# Altium schematic sheet 03.MCU_PA_JTAG.SchDoc
size 297 x 209 mm
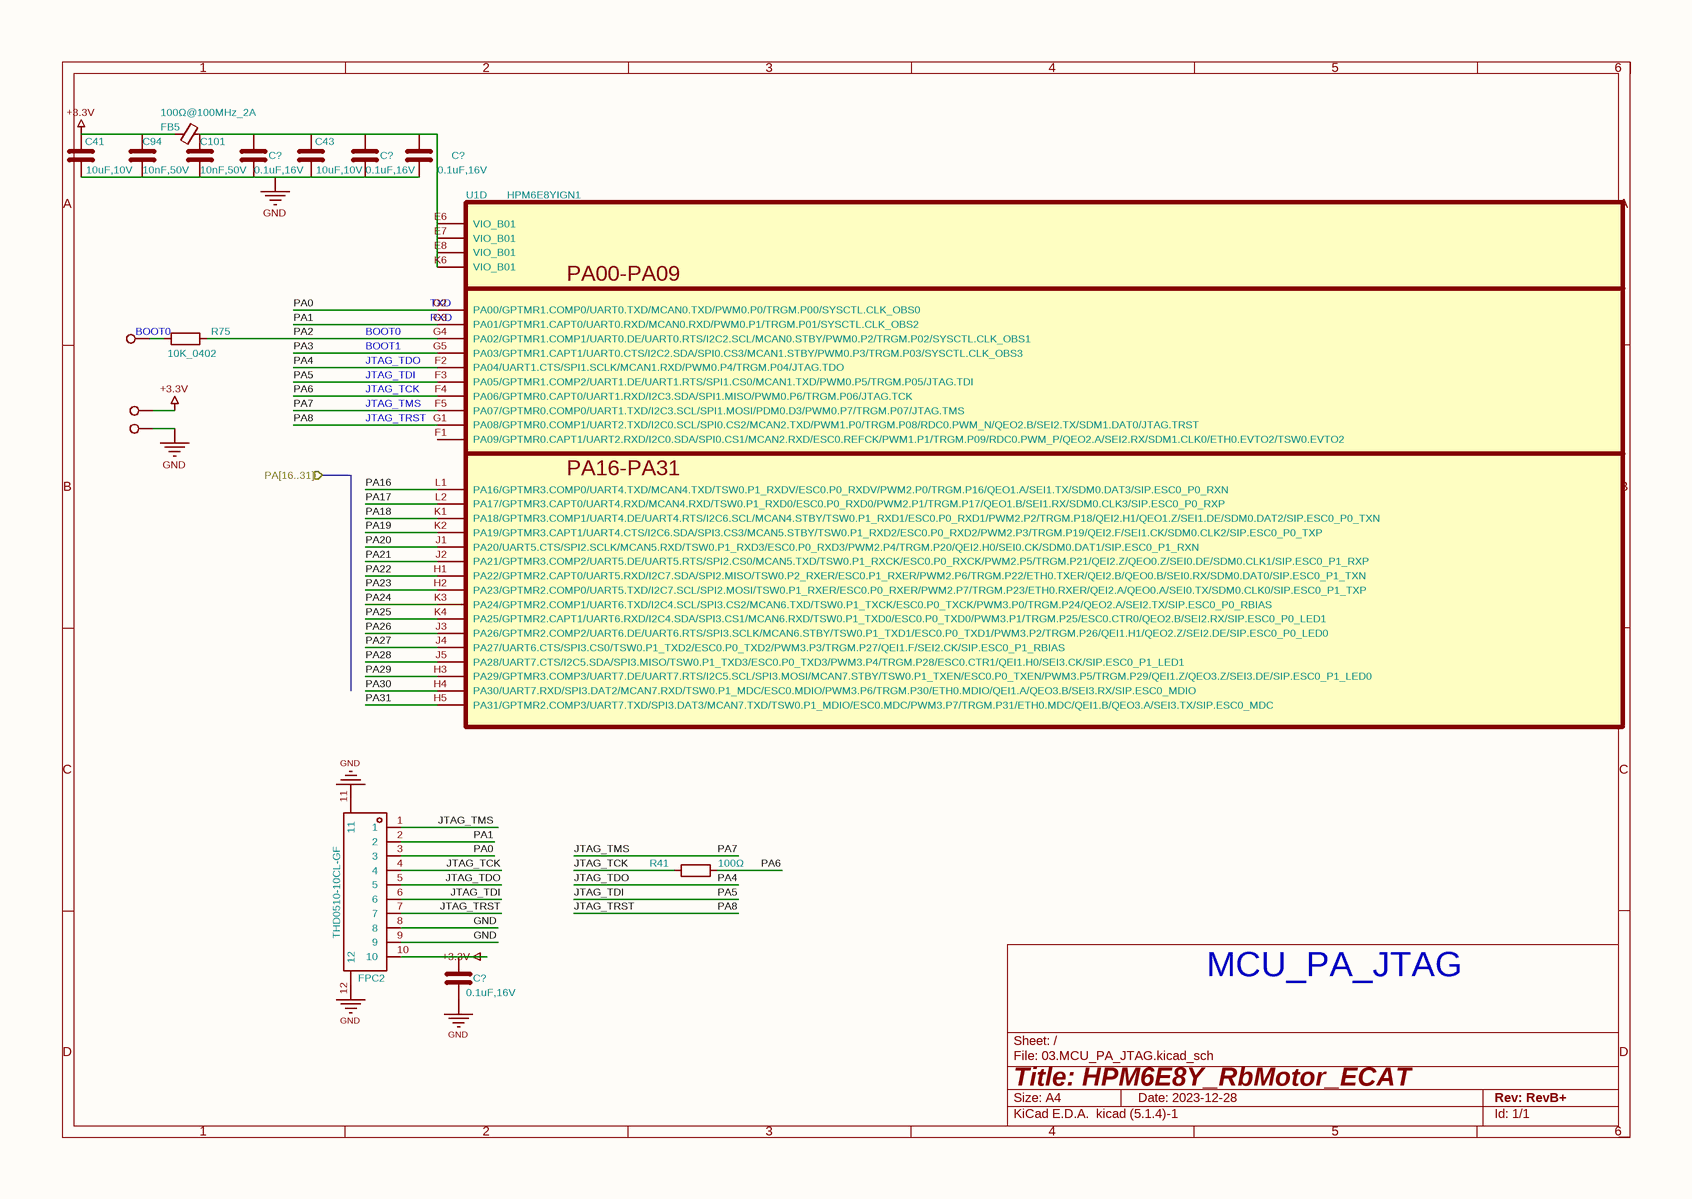
[diagram p0: 03.MCU_PA_JTAG.SchDoc]

## Parts
(Parts that share a designator on the sheet are numbered #1, #2 ... from top to bottom, then left to right.)
C41  10uF,10V  [C_0603_1608Metric]
C43  10uF,10V  [C_0603_1608Metric]
C94  10nF,50V  [C_0402_1005Metric]
C101  10nF,50V  [C_0402_1005Metric]
C?#1  0.1uF,16V  [C_0402]
C?#2  0.1uF,16V  [C_0402]
C?#3  0.1uF,16V  [C_0402]
C?#4  0.1uF,16V  [C_0402]
FB5  100Ω@100MHz_2A  [R_0603_1608Metric]
FPC2  THD0510-10CL-GF  [FPC_10P_0.5mm_JTAG]
R41  100Ω  [R_0402_1005Metric]
R75  10K_0402  [R_0402_1005Metric]
TP7  1.0mm  [TestPoint_1.5]  (value not drawn)
TP8  1.0mm  [TestPoint_1.5]  (value not drawn)
TP37  1.0mm  [TestPoint_1.5]  (value not drawn)
U1  HPM6E8YIGN1  [BGA-196_14x14_12.0x12.0mm_P0.8mm]  (part D of 10)

## Ports
PA[16..31] (in)

## Nets
+3.3V: C41.1 C94.1 C?#4.1 FB5.2 FPC2.10 TP8.1
GND: C41.2 C43.2 C94.2 C101.2 C?#1.2 C?#2.2 C?#3.2 C?#4.2 FPC2.8 FPC2.9 FPC2.11 FPC2.12 TP37.1
JTAG_TCK: FPC2.4 R41.1
JTAG_TDI: FPC2.6 U1.F3(PA05/GPTMR1.COMP2/UART1.DE/UART1.RTS/SPI1.CS0/MCAN1.TXD/PWM0.P5/TRGM.P05/JTAG.TDI)  [also labelled PA5]
JTAG_TDO: FPC2.5 U1.F2(PA04/UART1.CTS/SPI1.SCLK/MCAN1.RXD/PWM0.P4/TRGM.P04/JTAG.TDO)  [also labelled PA4]
JTAG_TMS: FPC2.1 U1.F5(PA07/GPTMR0.COMP0/UART1.TXD/I2C3.SCL/SPI1.MOSI/PDM0.D3/PWM0.P7/TRGM.P07/JTAG.TMS)  [also labelled PA7]
JTAG_TRST: FPC2.7 U1.G1(PA08/GPTMR0.COMP1/UART2.TXD/I2C0.SCL/SPI0.CS2/MCAN2.TXD/PWM1.P0/TRGM.P08/RDC0.PWM_N/QEO2.B/SEI2.TX/SDM1.DAT0/JTAG.TRST)  [also labelled PA8]
PA0: FPC2.3 U1.G2(PA00/GPTMR1.COMP0/UART0.TXD/MCAN0.TXD/PWM0.P0/TRGM.P00/SYSCTL.CLK_OBS0)
PA1: FPC2.2 U1.G3(PA01/GPTMR1.CAPT0/UART0.RXD/MCAN0.RXD/PWM0.P1/TRGM.P01/SYSCTL.CLK_OBS2)
PA2: R75.2 U1.G4(PA02/GPTMR1.COMP1/UART0.DE/UART0.RTS/I2C2.SCL/MCAN0.STBY/PWM0.P2/TRGM.P02/SYSCTL.CLK_OBS1)
PA3: U1.G5(PA03/GPTMR1.CAPT1/UART0.CTS/I2C2.SDA/SPI0.CS3/MCAN1.STBY/PWM0.P3/TRGM.P03/SYSCTL.CLK_OBS3)
PA6: R41.2 U1.F4(PA06/GPTMR0.CAPT0/UART1.RXD/I2C3.SDA/SPI1.MISO/PWM0.P6/TRGM.P06/JTAG.TCK)
PA16: U1.L1(PA16/GPTMR3.COMP0/UART4.TXD/MCAN4.TXD/TSW0.P1_RXDV/ESC0.P0_RXDV/PWM2.P0/TRGM.P16/QEO1.A/SEI1.TX/SDM0.DAT3/SIP.ESC0_P0_RXN)
PA17: U1.L2(PA17/GPTMR3.CAPT0/UART4.RXD/MCAN4.RXD/TSW0.P1_RXD0/ESC0.P0_RXD0/PWM2.P1/TRGM.P17/QEO1.B/SEI1.RX/SDM0.CLK3/SIP.ESC0_P0_RXP)
PA18: U1.K1(PA18/GPTMR3.COMP1/UART4.DE/UART4.RTS/I2C6.SCL/MCAN4.STBY/TSW0.P1_RXD1/ESC0.P0_RXD1/PWM2.P2/TRGM.P18/QEI2.H1/QEO1.Z/SEI1.DE/SDM0.DAT2/SIP.ESC0_P0_TXN)
PA19: U1.K2(PA19/GPTMR3.CAPT1/UART4.CTS/I2C6.SDA/SPI3.CS3/MCAN5.STBY/TSW0.P1_RXD2/ESC0.P0_RXD2/PWM2.P3/TRGM.P19/QEI2.F/SEI1.CK/SDM0.CLK2/SIP.ESC0_P0_TXP)
PA20: U1.J1(PA20/UART5.CTS/SPI2.SCLK/MCAN5.RXD/TSW0.P1_RXD3/ESC0.P0_RXD3/PWM2.P4/TRGM.P20/QEI2.H0/SEI0.CK/SDM0.DAT1/SIP.ESC0_P1_RXN)
PA21: U1.J2(PA21/GPTMR3.COMP2/UART5.DE/UART5.RTS/SPI2.CS0/MCAN5.TXD/TSW0.P1_RXCK/ESC0.P0_RXCK/PWM2.P5/TRGM.P21/QEI2.Z/QEO0.Z/SEI0.DE/SDM0.CLK1/SIP.ESC0_P1_RXP)
PA22: U1.H1(PA22/GPTMR2.CAPT0/UART5.RXD/I2C7.SDA/SPI2.MISO/TSW0.P2_RXER/ESC0.P1_RXER/PWM2.P6/TRGM.P22/ETH0.TXER/QEI2.B/QEO0.B/SEI0.RX/SDM0.DAT0/SIP.ESC0_P1_TXN)
PA23: U1.H2(PA23/GPTMR2.COMP0/UART5.TXD/I2C7.SCL/SPI2.MOSI/TSW0.P1_RXER/ESC0.P0_RXER/PWM2.P7/TRGM.P23/ETH0.RXER/QEI2.A/QEO0.A/SEI0.TX/SDM0.CLK0/SIP.ESC0_P1_TXP)
PA24: U1.K3(PA24/GPTMR2.COMP1/UART6.TXD/I2C4.SCL/SPI3.CS2/MCAN6.TXD/TSW0.P1_TXCK/ESC0.P0_TXCK/PWM3.P0/TRGM.P24/QEO2.A/SEI2.TX/SIP.ESC0_P0_RBIAS)
PA25: U1.K4(PA25/GPTMR2.CAPT1/UART6.RXD/I2C4.SDA/SPI3.CS1/MCAN6.RXD/TSW0.P1_TXD0/ESC0.P0_TXD0/PWM3.P1/TRGM.P25/ESC0.CTR0/QEO2.B/SEI2.RX/SIP.ESC0_P0_LED1)
PA26: U1.J3(PA26/GPTMR2.COMP2/UART6.DE/UART6.RTS/SPI3.SCLK/MCAN6.STBY/TSW0.P1_TXD1/ESC0.P0_TXD1/PWM3.P2/TRGM.P26/QEI1.H1/QEO2.Z/SEI2.DE/SIP.ESC0_P0_LED0)
PA27: U1.J4(PA27/UART6.CTS/SPI3.CS0/TSW0.P1_TXD2/ESC0.P0_TXD2/PWM3.P3/TRGM.P27/QEI1.F/SEI2.CK/SIP.ESC0_P1_RBIAS)
PA28: U1.J5(PA28/UART7.CTS/I2C5.SDA/SPI3.MISO/TSW0.P1_TXD3/ESC0.P0_TXD3/PWM3.P4/TRGM.P28/ESC0.CTR1/QEI1.H0/SEI3.CK/SIP.ESC0_P1_LED1)
PA29: U1.H3(PA29/GPTMR3.COMP3/UART7.DE/UART7.RTS/I2C5.SCL/SPI3.MOSI/MCAN7.STBY/TSW0.P1_TXEN/ESC0.P0_TXEN/PWM3.P5/TRGM.P29/QEI1.Z/QEO3.Z/SEI3.DE/SIP.ESC0_P1_LED0)
PA30: U1.H4(PA30/UART7.RXD/SPI3.DAT2/MCAN7.RXD/TSW0.P1_MDC/ESC0.MDIO/PWM3.P6/TRGM.P30/ETH0.MDIO/QEI1.A/QEO3.B/SEI3.RX/SIP.ESC0_MDIO)
PA31: U1.H5(PA31/GPTMR2.COMP3/UART7.TXD/SPI3.DAT3/MCAN7.TXD/TSW0.P1_MDIO/ESC0.MDC/PWM3.P7/TRGM.P31/ETH0.MDC/QEI1.B/QEO3.A/SEI3.TX/SIP.ESC0_MDC)
NetC43_1: C43.1 C101.1 C?#1.1 C?#2.1 C?#3.1 FB5.1 U1.E6(VIO_B01) U1.E7(VIO_B01) U1.E8(VIO_B01) U1.K6(VIO_B01)
NetR75_1: R75.1 TP7.1

Not connected (* = marked no-connect by the designer): U1 F1(PA09/GPTMR0.CAPT1/UART2.RXD/I2C0.SDA/SPI0.CS1/MCAN2.RXD/ESC0.REFCK/PWM1.P1/TRGM.P09/RDC0.PWM_P/QEO2.A/SEI2.RX/SDM1.CLK0/ETH0.EVTO2/TSW0.EVTO2)

## Notes on the sheet
- (near TP7) BOOT0
- BOOT1
- JTAG_TDO
- BOOT0
- (near U1) RXD
- (near U1) TXD
- (near U1) JTAG_TRST
- JTAG_TMS
- JTAG_TCK
- JTAG_TDI
- MCU_PA_JTAG
- 1
- 2
- 3
- 4
- 5
- 6
- A
- B
- C
- D
- Title: HPM6E8Y_RbMotor_ECAT
- File: 03.MCU_PA_JTAG.kicad_sch
- Sheet: /
- KiCad E.D.A.  kicad (5.1.4)-1
- Size: A4
- Date: 2023-12-28
- Rev: RevB+
- Id: 1/1
- (in symbol HPM6E8YIGN1, part D) PA00-PA09; PA16-PA31

## Library data of the parts
C41 C43 = 10uF,10V_0603: Model: CL10A106KP8NNNC; Company: SAMSUNG(三星); Value: 10uF,10V; Footprint: 03_HPM_Capacitance:C_0603_1608Metric
C94 C101 = 10nF,50V_0402: Model: CL05B103KB5NNNC; Company: SAMSUNG(三星); Value: 10nF,50V; Footprint: 03_HPM_Capacitance:C_0402_1005Metric
C?#1-C?#4 = 0.1uF,16V_0402: Model: CL05B104KO5NNNC; Company: SAMSUNG(三星); Value: 0.1uF,16V; Footprint: 03_HPM_Capacitance:C_0402
FB5 = 磁珠-100Ω@100MHz_2A_0603: Model: PZ1608D101-2R0TF; Company: Sunlord(顺络); Value: 100Ω@100MHz_2A; Footprint: 02_HPM_Resistor:R_0603_1608Metric
FPC2 = FPC_10P_0.5MM_JTAG: Company: THD(台华达); Model: THD0510-10CL-GF; Value: THD0510-10CL-GF; Footprint: 13_ower:FPC_10P_0.5mm_JTAG
R41 = 100Ω_0402: Model: 0402WGF1000TCE; Company: UNI-ROYAL(厚声); Value: 100Ω; Footprint: 02_HPM_Resistor:R_0402_1005Metric
R75 = 10K_0402: Model: 0402WGF1002TCE; Company: UNI-ROYAL(厚声); Value: 10K_0402; Footprint: 02_HPM_Resistor:R_0402_1005Metric
TP7 TP8 TP37 = TestPoint-1.0mm: Value: 1.0mm; Footprint: 01_HPM_Peripheral:TestPoint_1.5
U1 = HPM6E8YIGN1: Value: HPM6E8YIGN1; Footprint: 00_HPM_Library:BGA-196_14x14_12.0x12.0mm_P0.8mm